# Altium schematic sheet ArrayDiodeBoard.SchDoc
size A
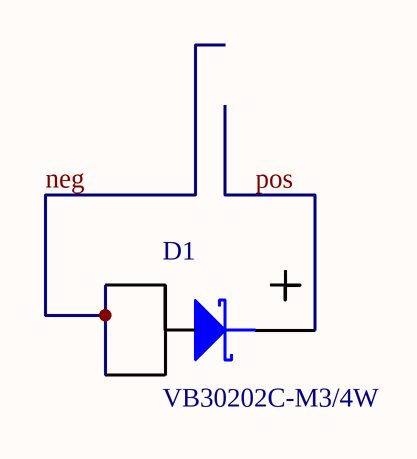
[diagram p0: ArrayDiodeBoard.SchDoc]

## Parts
D1  VB30202C-M3/4W  [D2PAK]

## Nets
neg: D1.1(A1) D1.3(A2)
pos: D1.2(K)

## Library data of the parts
D1 = Active Array Diode SM74611KTTR: Datasheet: https://www.mouser.com/datasheet/2/427/v30202c-1768217.pdf; Mouser: https://www.mouser.com/ProductDetail/Vishay-Semiconductors/VB30202C-M3-4W?qs=qH96uQk6rZqpKMT84gIjjQ%3D%3D